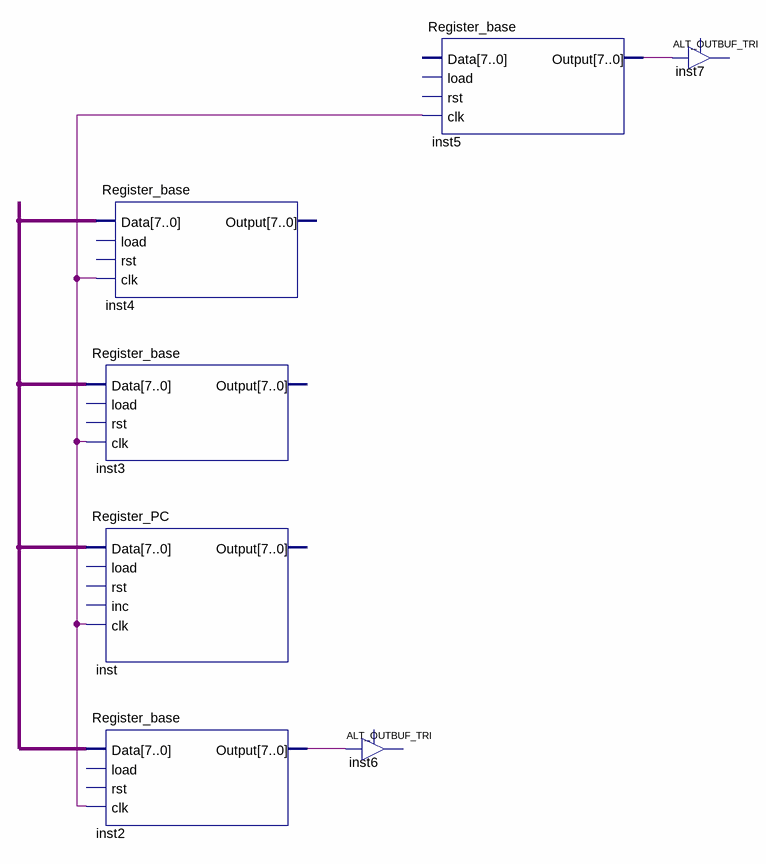
[diagram p0: schematic sheet]
// Quartus schematic cpu8.bdf as structural Verilog: 7 symbols, 0 pins
module cpu8 (
);

  wire inst2_output, inst5_output, undriven;
  wire [7:0] undriven_2;

  Register_base inst4 (.Data(undriven_2), .clk(undriven));  // open: load, rst, Output
  Register_base inst3 (.Data(undriven_2), .clk(undriven));  // open: load, rst, Output
  Register_PC inst (.Data(undriven_2), .clk(undriven));  // open: load, rst, inc, Output
  Register_base inst2 (.Data(undriven_2), .clk(undriven), .Output(inst2_output));  // open: load, rst
  ALT_OUTBUF_TRI inst6 (.i(inst2_output));  // open: oe, o
  Register_base inst5 (.clk(undriven), .Output(inst5_output));  // open: Data, load, rst
  ALT_OUTBUF_TRI inst7 (.i(inst5_output));  // open: oe, o
endmodule
